# Altium schematic sheet PLL.SchDoc
size A4
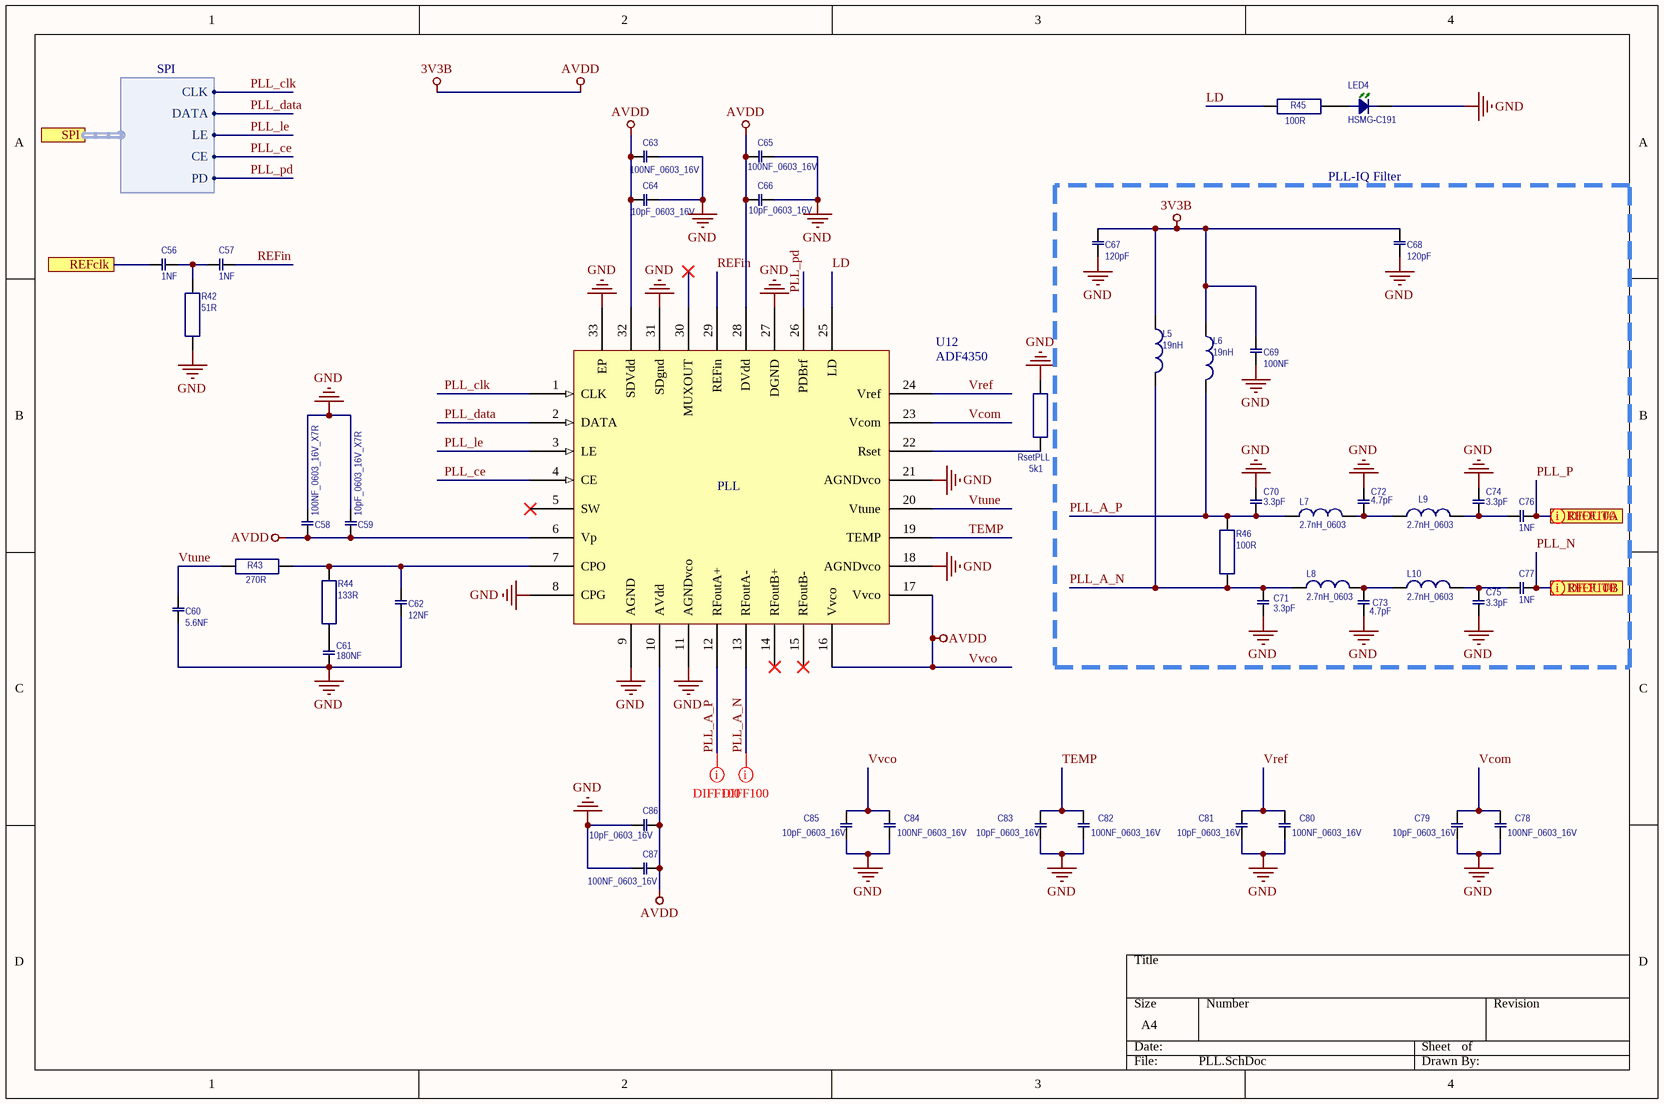
[diagram p0: PLL.SchDoc]

## Parts
C56  1NF  [CAP0603]
C57  1NF  [CAP0603]
C58  100NF_0603_16V_X7R  [CAP0603]
C59  10pF_0603_16V_X7R  [CAP0603]
C60  5.6NF  [CAP0603]
C61  180NF  [CAP0603]
C62  12NF  [CAP0603]
C63  100NF_0603_16V  [CAP0603]
C64  10pF_0603_16V  [CAP0603]
C65  100NF_0603_16V  [CAP0603]
C66  10pF_0603_16V  [CAP0603]
C67  120pF  [CAP0603]
C68  120pF  [CAP0603]
C69  100NF  [CAP0603]
C70  3.3pF  [CAP0603]
C71  3.3pF  [CAP0603]
C72  4.7pF  [CAP0603]
C73  4.7pF  [CAP0603]
C74  3.3pF  [CAP0603]
C75  3.3pF  [CAP0603]
C76  1NF  [CAP0603]
C77  1NF  [CAP0603]
C78  100NF_0603_16V  [CAP0603]
C79  10pF_0603_16V  [CAP0603]
C80  100NF_0603_16V  [CAP0603]
C81  10pF_0603_16V  [CAP0603]
C82  100NF_0603_16V  [CAP0603]
C83  10pF_0603_16V  [CAP0603]
C84  100NF_0603_16V  [CAP0603]
C85  10pF_0603_16V  [CAP0603]
C86  10pF_0603_16V  [CAP0603]
C87  100NF_0603_16V  [CAP0603]
L5  19nH  [0603]
L6  19nH  [0603]
L7  2.7nH_0603  [0603]
L8  2.7nH_0603  [0603]
L9  2.7nH_0603  [0603]
L10  2.7nH_0603  [0603]
LED4  HSMG-C191  [D0603]
R42  51R  [R0603]
R43  270R  [R0603]
R44  133R  [R0603]
R45  100R  [R0603]
R46  100R  [R0603]
RsetPLL  5k1  [R0603]
U12  ADF4350  [LFCSP8]

## Blocks framed on the sheet
PLL-IQ Filter: C67-C77 L5-L10 R46

## Ports
REFclk, RFOUTA, RFOUTB, SPI (harness SPI)

## Harnesses
SPI: CLK, DATA, LE, CE, PD

## Nets
GND: C58.2 C59.2 C60.2 C61.2 C62.2 C63.2 C64.2 C65.2 C66.2 C67.2 C68.2 C69.2 C70.1 C71.2 C72.1 C73.2 C74.1 C75.2 C78.2 C79.2 C80.2 C81.2 C82.2 C83.2 C84.2 C85.2 C86.2 C87.2 LED4.K R42.1 RsetPLL.1 U12.8(CPG) U12.9(AGND) U12.11(AGNDvco) U12.18(AGNDvco) U12.21(AGNDvco) U12.27(DGND) U12.31(SDgnd) U12.33(EP)
Vvco: C58.1 C59.1 C63.1 C64.1 C65.1 C66.1 C67.1 C68.1 C69.1 C84.1 C85.1 C86.1 C87.1 L5.1 L6.1 U12.6(Vp) U12.10(AVdd) U12.16(Vvco) U12.17(Vvco) U12.28(DVdd) U12.32(SDVdd)  [also labelled 3V3B, AVDD]
LD: R45.1 U12.25(LD)
PLL_A_N: C71.1 L5.2 L8.1 R46.1 U12.13(RFoutA-)
PLL_A_P: C70.2 L6.2 L7.1 R46.2 U12.12(RFoutA+)
PLL_ce: U12.4(CE) ; port SPI.CE
PLL_clk: U12.1(CLK) ; port SPI.CLK
PLL_data: U12.2(DATA) ; port SPI.DATA
PLL_le: U12.3(LE) ; port SPI.LE
PLL_N: C77.2 ; port RFOUTB
PLL_P: C76.2 ; port RFOUTA
PLL_pd: U12.26(PDBrf) ; port SPI.PD
REFclk: C56.1 ; port REFclk
REFin: C57.2 U12.29(REFin)
TEMP: C82.1 C83.1 U12.19(TEMP)
Vcom: C78.1 C79.1 U12.23(Vcom)
Vref: C80.1 C81.1 U12.24(Vref)
Vtune: C60.1 R43.2 U12.20(Vtune)
NetC56_2: C56.2 C57.1 R42.2
NetC61_1: C61.1 R44.1
NetC62_1: C62.1 R43.1 R44.2 U12.7(CPO)
NetC72_2: C72.2 L7.2 L9.1
NetC73_1: C73.1 L8.2 L10.1
NetC74_2: C74.2 C76.1 L9.2
NetC75_1: C75.1 C77.1 L10.2
NetLED4_A: LED4.A R45.2
NetRsetPLL_2: RsetPLL.2 U12.22(Rset)

Not connected (* = marked no-connect by the designer): U12 5(SW)* 14(RFoutB+)* 15(RFoutB-)* 30(MUXOUT)*

## Layout directives
differential pair; net class DIFF_PLL: PLL_A_N, PLL_A_P, PLL_N, PLL_P

## Notes on the sheet
- (in symbol ADF4150) PLL

## Library data of the parts
C56-C66 C69 C76-C87 = 100NF_0603_50V_X7R: 128-8255    Capacitor MLC-X7R_0603_100NF_10%_50V; C0603C104K5RAC; KEMET; RoHS=Yes
C67 C68 C70-C75 = 100PF_0603_50V_NP0: 141-4603    Capacitor MLC-NPO_0603_100PF_5%_50V; C0603C101J5GAC; KEMET; RoHS=Yes
L5-L10 = Inductor0603
LED4 = HSMG-C191: 855-4617    LED DIODE GREEN 20mA, 0603; HSMG-C191; AVAGO TECHNOLOGIES; RoHS=Yes
R42 = 120R_0603_0.1W_1%: 165-2832    RESISTOR MF_0603_120R_0.1W_1%_75V; CRCW0603120RFKEA; VISHAY; RoHS=Yes
R43 R44 R46 = 100R_0603_0.1W_1%: 146-9752    RESISTOR MF_0603_100R_0.1W_1%_75V; CRCW0603100RFKEA; VISHAY; RoHS=Yes
R45 = 0.0R_0603_0.063W_5%: 923-3130    RESISTOR MF_0603_0.0R_0.1W_50V; RC0603JR-070RL; YAGEO; RoHS=Yes
RsetPLL = 4K7_0603_0.1W_1%: 146-9807    RESISTOR MF_0603_4K7_0.1W_1%_75V; CRCW06034K70FKEA; VISHAY; RoHS=Yes
U12 = ADF4150